# Altium schematic sheet ADS_AFE.SchDoc
size A4; SheetNumber: 10; SheetTotal: 11
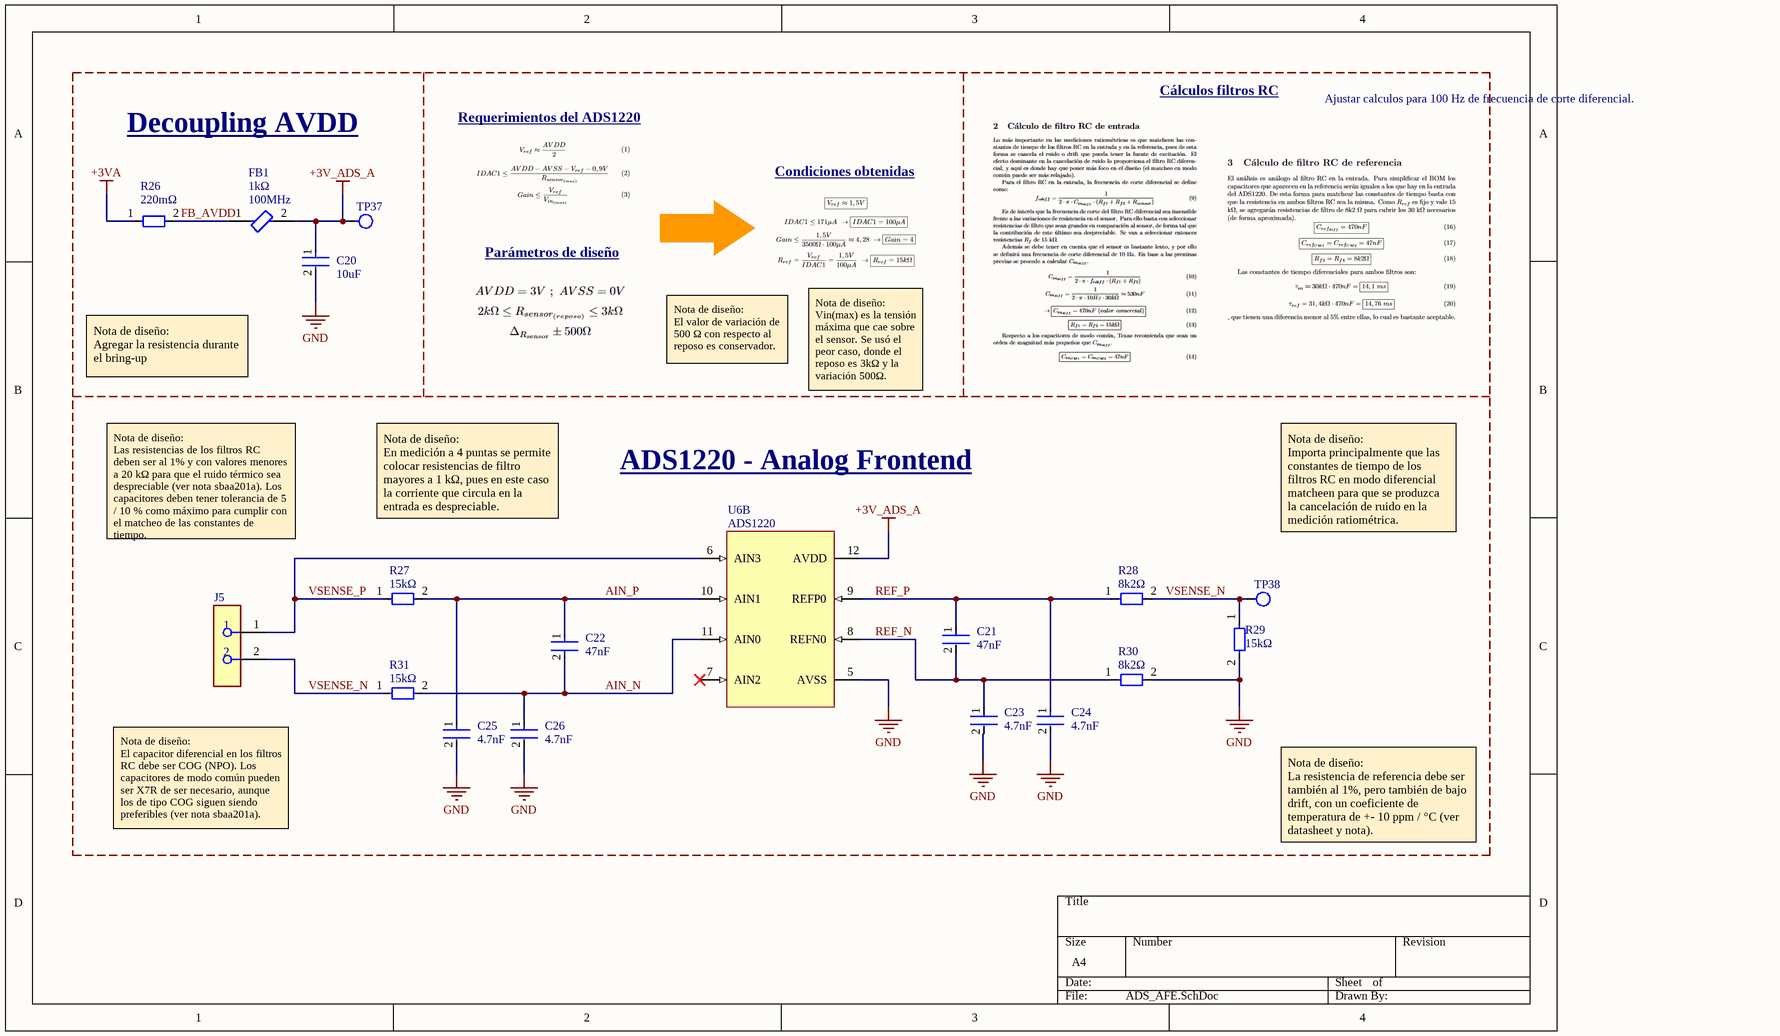
[diagram p0: ADS_AFE.SchDoc]

## Parts
C20  10uF  [CAP_0603]
C21  Capacitance: 47nF  [CAP_0603]  (hidden comment: 470nF)
C22  Capacitance: 47nF  [CAP_0603]  (hidden comment: 470nF)
C23  Capacitance: 4.7nF  [CAP_0603]  (hidden comment: 47nF)
C24  Capacitance: 4.7nF  [CAP_0603]  (hidden comment: 47nF)
C25  Capacitance: 4.7nF  [CAP_0603]  (hidden comment: 47nF)
C26  Capacitance: 4.7nF  [CAP_0603]  (hidden comment: 47nF)
FB1  Impedance: 1kΩ  Test Frequency: 100MHz  [FP-MPZ2012-IPC_B]  (hidden comment: MPZ2012S102AT000)
J5  PPTC021LGBN-RC  [FP-PPTC021LGBN-RC-MFG]  (value not drawn)
R26  value 220mΩ  [RES_0603]  (hidden comment: 220mOhm)
R27  value 15kΩ  [RES_0603]  (hidden comment: 15k)
R28  value 8k2Ω  [RES_0603]  (hidden comment: 8k2)
R29  value 15kΩ  [RES_0603]  (hidden comment: 15k REF)
R30  value 8k2Ω  [RES_0603]  (hidden comment: 8k2)
R31  value 15kΩ  [RES_0603]  (hidden comment: 15k)
TP37  Testpoint SMD  [Testpoint_SMD]  (value not drawn)  (no BOM)
TP38  Testpoint SMD  [Testpoint_SMD]  (value not drawn)  (no BOM)
U6  ADS1220  [TSSOP-16]  (part B of 2)

## Nets
+3V_ADS_A: C20.1 FB1.2 TP37.1 U6.12(AVDD)
+3VA: R26.1
GND: C20.2 C23.2 C24.2 C25.2 C26.2 R29.2 R30.2 U6.5(AVSS)
AIN_N: C22.2 C26.1 R31.2 U6.11(AIN0)
AIN_P: C22.1 C25.1 R27.2 U6.10(AIN1)
FB_AVDD: FB1.1 R26.2
REF_N: C21.2 C23.1 R30.1 U6.8(REFN0)
REF_P: C21.1 C24.1 R28.1 U6.9(REFP0)
VSENSE_N: J5.2 R28.2 R29.1 R31.1 TP38.1
VSENSE_P: J5.1 R27.1 U6.6(AIN3)

Not connected (* = marked no-connect by the designer): U6 7(AIN2)*

## Notes on the sheet
- Cálculos filtros RC
- Ajustar calculos para 100 Hz de frecuencia de corte diferencial.
- Decoupling AVDD
- Requerimientos del ADS1220
- Condiciones obtenidas
- Parámetros de diseño
- Nota de diseño:
  Agregar la resistencia durante el bring-up
- Nota de diseño:
  El valor de variación de 500 Ω con respecto al reposo es conservador.
- Nota de diseño:
  Vin(max) es la tensión máxima que cae sobre el sensor. Se usó el peor caso, donde el reposo es 3kΩ y la variación 500Ω.
- Nota de diseño:
  En medición a 4 puntas se permite colocar resistencias de filtro mayores a 1 kΩ, pues en este caso la corriente que circula en la entrada es despreciable.
- ADS1220 - Analog Frontend
- Nota de diseño:
  Las resistencias de los filtros RC deben ser al 1% y con valores menores a 20 kΩ para que el ruido térmico sea despreciable (ver nota sbaa201a). Los capacitores deben tener tolerancia de 5 / 10 % como máximo para cumplir con el matcheo de las constantes de tiempo.
- Nota de diseño:
  Importa principalmente que las constantes de tiempo de los filtros RC en modo diferencial matcheen para que se produzca la cancelación de ruido en la medición ratiométrica.
- Nota de diseño:
  El capacitor diferencial en los filtros RC debe ser COG (NPO). Los capacitores de modo común pueden ser X7R de ser necesario, aunque los de tipo COG siguen siendo preferibles (ver nota sbaa201a).
- Nota de diseño:
  La resistencia de referencia debe ser también al 1%, pero también de bajo drift, con un coeficiente de temperatura de +- 10 ppm / °C (ver datasheet y nota).

## Library data of the parts
C20 = Generic C: Cap 10 uF 10V X7R 0603; Dielectric: X5R; Tolerance: 10%; Case Code (Imperial): 0805; Capacitance: 10uF; Mount: Surface Mount; Depth: 1.25mm; Length: 2mm; Lead Free: Lead Free; Packaging: Tape and Reel; Width: 0.049inch; Package Quantity: 1; Height: 1.25mm; Case/Package: 0805; Voltage Rating: 10V; Thickness: 0.053inch; Max Operating Temperature: 85°C; Case Code (Metric): 2012; Contact Plating: Tin; Min Operating Temperature: -55°C; Radiation Hardening: No; Voltage Rating (DC): 10V
C21 C22 = Generic C: Cap 470 nF 10V C0G 0603; Dielectric: X5R; Tolerance: 10%; Case Code (Imperial): 0805; Mount: Surface Mount; Depth: 1.25mm; Length: 2mm; Lead Free: Lead Free; Packaging: Tape and Reel; Width: 0.049inch; Package Quantity: 1; Height: 1.25mm; Case/Package: 0805; Voltage Rating: 10V; Thickness: 0.053inch; Max Operating Temperature: 85°C; Case Code (Metric): 2012; Contact Plating: Tin; Min Operating Temperature: -55°C; Radiation Hardening: No; Voltage Rating (DC): 10V
C23-C26 = Generic C: Cap 47 nF 10V X7R 0603; Dielectric: X5R; Tolerance: 10%; Case Code (Imperial): 0805; Mount: Surface Mount; Depth: 1.25mm; Length: 2mm; Lead Free: Lead Free; Packaging: Tape and Reel; Width: 0.049inch; Package Quantity: 1; Height: 1.25mm; Case/Package: 0805; Voltage Rating: 10V; Thickness: 0.053inch; Max Operating Temperature: 85°C; Case Code (Metric): 2012; Contact Plating: Tin; Min Operating Temperature: -55°C; Radiation Hardening: No; Voltage Rating (DC): 10V
FB1 = CMP-08257-000042-1: FERRITE BEAD 1 KOHM 0805 1LN; Max DC Current: 1.5A; Tolerance: 25%; DC Resistance (DCR): 150mR; Depth: 1.25mm; REACH SVHC: No SVHC; Case Code (Imperial): 0805; Length: 0.079inch; Core Material: Ferrite; Mount: Surface Mount; Packaging: Tape and Reel; Case/Package: 0805; Weight: 0.000194oz; Width: 1.25mm; Height: 0.85mm; Case Code (Metric): 2012; Max Operating Temperature: 125°C; Termination: SMD/SMT; Current Rating: 1.5A; Min Operating Temperature: -55°C; RoHS Compliant: Yes; Package Quantity: 4000
J5 = CMP-00595-00270342-1: PPTC021LGBN-RC 2 Position Total Single Row 2.54 mm Pitch Right Angle Female Header; NexarPartId: 270342; Pitch: 2.54mm; Current Rating: 3A; Number of Positions: 2; Voltage Rating: 250V; Connector Type: Header, Socket; Lead Free: Lead Free; Height: 2.4mm; Contact Material: Bronze, Nickel, Tin; Color: Black; RoHS: Compliant; Width: 8.5mm; Min Operating Temperature: -40°C; Housing Color: Black; Max Operating Temperature: 105°C; Termination: Solder; Mount: Through Hole; Packaging: Bulk; Contact Plating: Tin; Number of Rows: 1; Housing Material: Plastic; Length: 5.58mm; Number of Contacts: 2
R26 = Generic R: RES  220mOhm 1% 0603
R27 R31 = Generic R: RES  15k 1% 0603
R28 R30 = Generic R: RES  8k2 1% 0603
R29 = Generic R: RES  8k2 1% 0603, low drift  +- 10 ppm / °C.
TP37 TP38 = Testpoint_SMD: Testpoint SMD de 1mm de diametro.
U6 = ADS1220: ADS1220 4-Channel, 2-kSPS, Low-Power, 24-Bit ADC with Integrated PGA and Reference